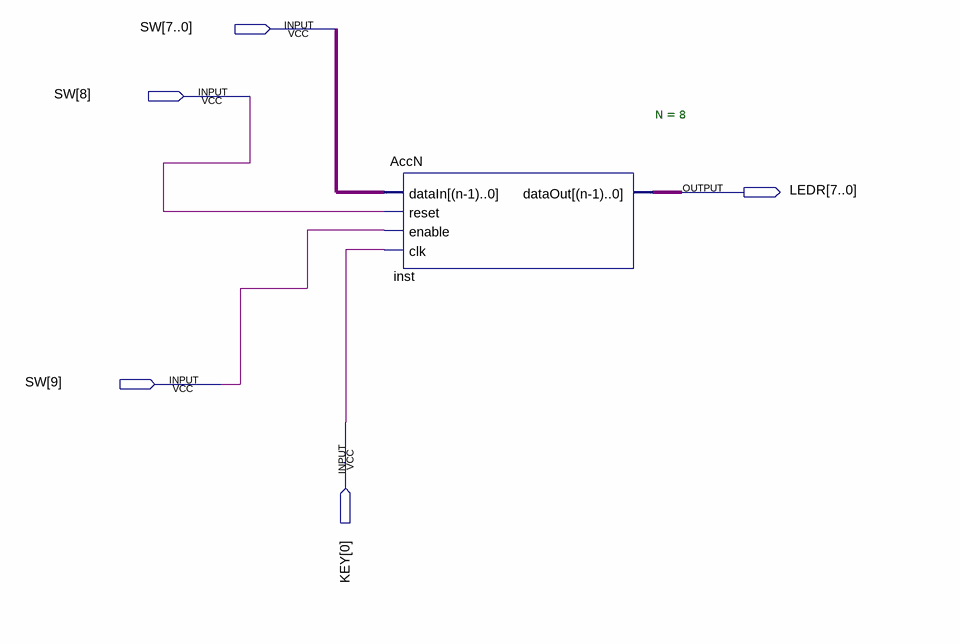
[diagram p0: schematic sheet]
// Quartus schematic Block1.bdf as structural Verilog: 1 symbols, 5 pins
module Block1 (
  input  [9:0] SW,
  input  [0:0] KEY,
  output [7:0] LEDR
);

  AccN #(.N(8)) inst (.dataIn(SW[7:0]), .reset(SW[8]), .enable(SW[9]), .clk(KEY[0]), .dataOut(LEDR));
endmodule
